# EAGLE schematic vixen-64k (EAGLE 7.7.0)
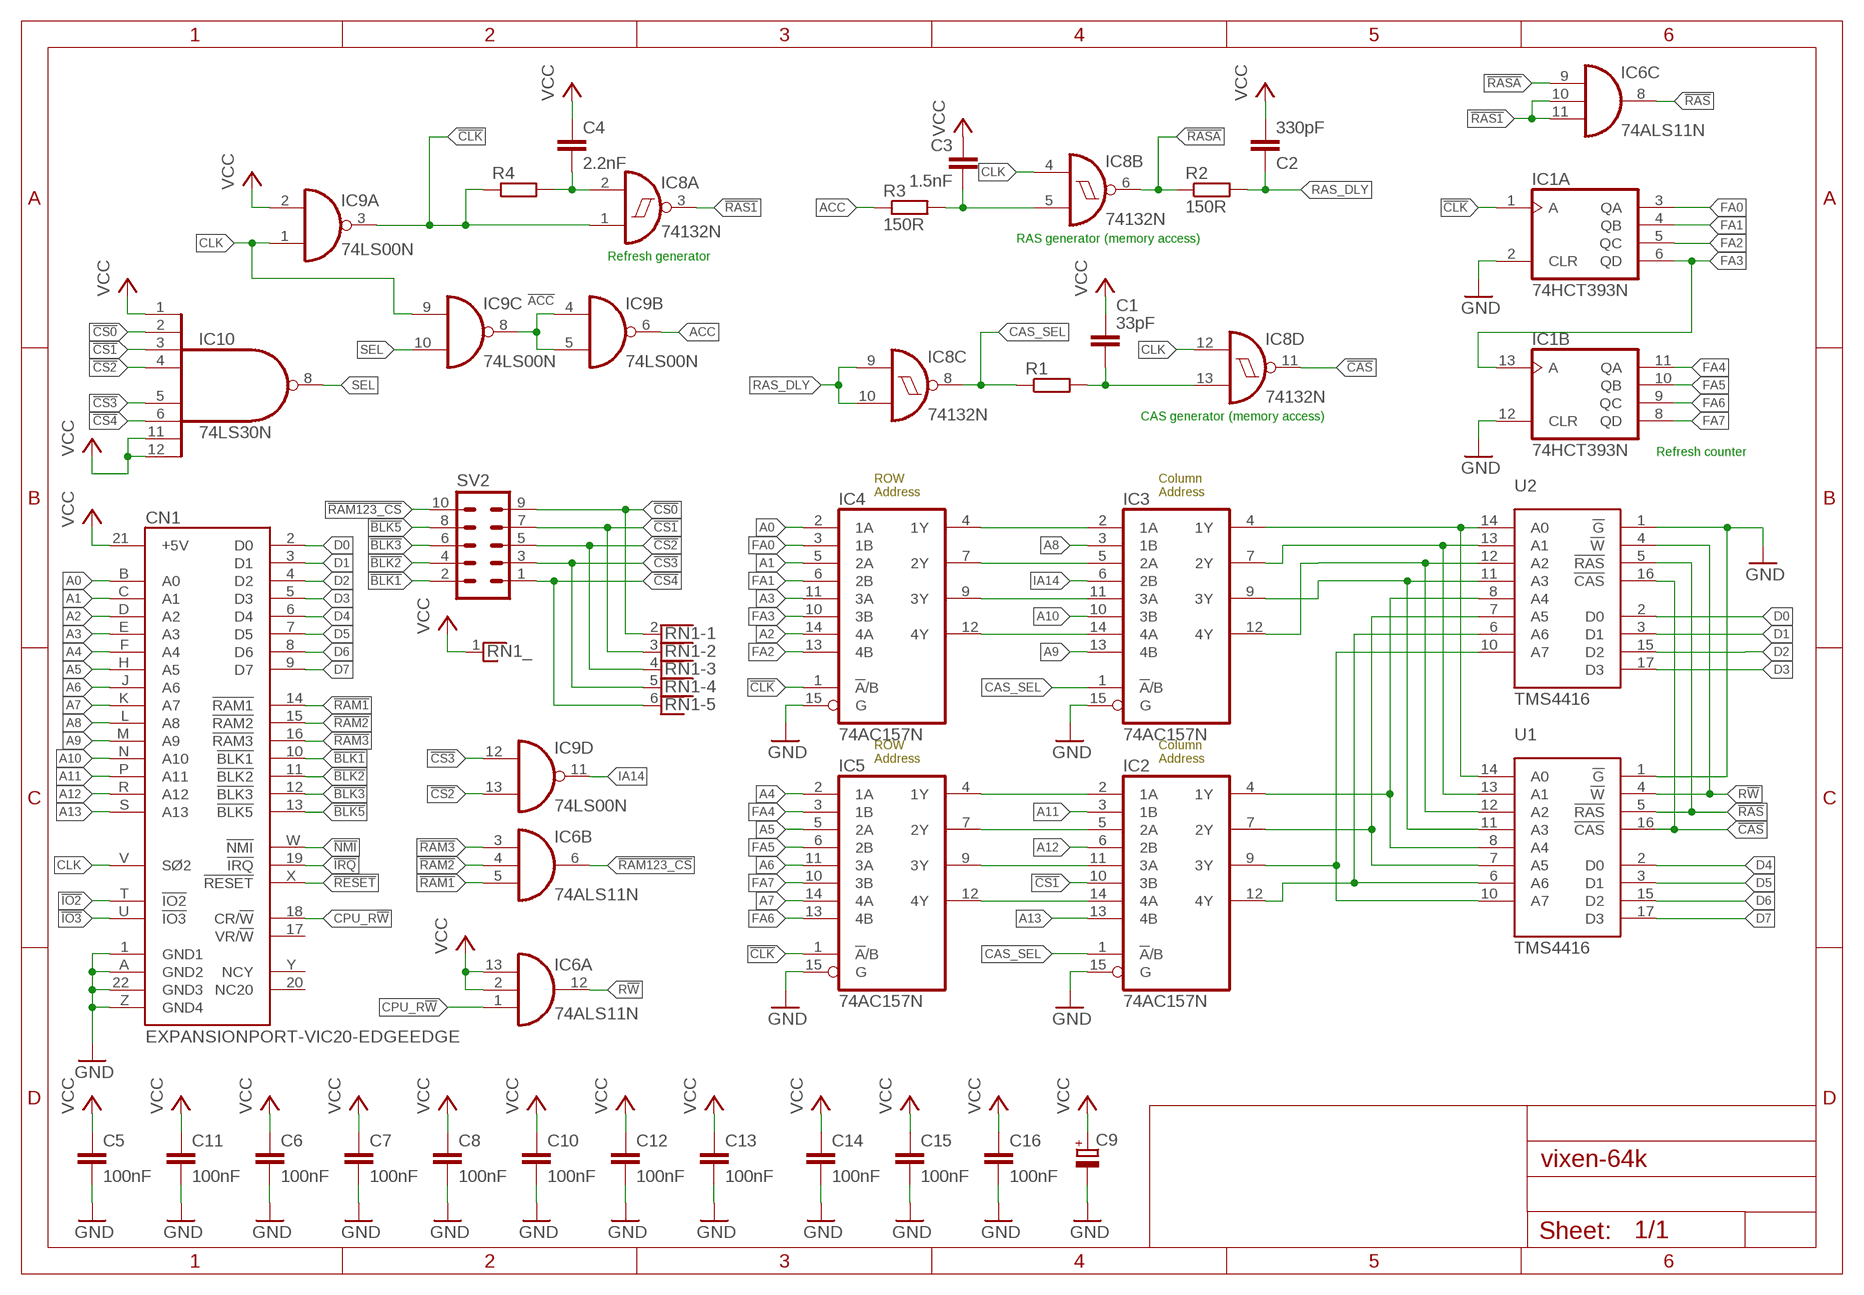
[diagram p0: schematic, sheet 1]

## Parts
C1  33pF  C-EU025-025X050  [C025-025X050]
C2  330pF  C-EU025-025X050  [C025-025X050]
C3  1.5nF  C-EU025-025X050  [C025-025X050]
C4  2.2nF  C-EU025-025X050  [C025-025X050]
C5  100nF  C-EU025-025X050  [C025-025X050]
C6  100nF  C-EU025-025X050  [C025-025X050]
C7  100nF  C-EU025-025X050  [C025-025X050]
C8  100nF  C-EU025-025X050  [C025-025X050]
C9  CPOL-EUE15-5AXIAL  [E15-5]
C10  100nF  C-EU025-025X050  [C025-025X050]
C11  100nF  C-EU025-025X050  [C025-025X050]
C12  100nF  C-EU025-025X050  [C025-025X050]
C13  100nF  C-EU025-025X050  [C025-025X050]
C14  100nF  C-EU025-025X050  [C025-025X050]
C15  100nF  C-EU025-025X050  [C025-025X050]
C16  100nF  C-EU025-025X050  [C025-025X050]
CN1  EXPANSIONPORT-VIC20-EDGEEDGE  [UPS44EDGE]
IC1  74HCT393N  [DIL14]
IC2  74AC157N  [DIL16]
IC3  74AC157N  [DIL16]
IC4  74AC157N  [DIL16]
IC5  74AC157N  [DIL16]
IC6  74ALS11N  [DIL14]
IC8  74132N  [DIL14]
IC9  74LS00N  [DIL14]
IC10  74LS30N  [DIL14]
R1  R-EU_0204/7  [0204/7]
R2  150R  R-EU_0204/7  [0204/7]
R3  150R  R-EU_0204/7  [0204/7]
R4  R-EU_0204/7  [0204/7]
RN1  RNX5  [RN-6]
SV2  MA05-2  [MA05-2]
U1  TMS4416  [DIL18]
U2  TMS4416  [DIL18]

## Nets
!ACC: IC9.4(B:I0) IC9.5(B:I1) IC9.8(C:O)
!BLK1: CN1.10(!BLK1) SV2.2
!BLK2: CN1.11(!BLK2) SV2.4
!BLK3: CN1.12(!BLK3) SV2.6
!BLK5: CN1.13(!BLK5) SV2.8
!CAS: IC8.11(D:O) U1.16(!CAS) U2.16(!CAS)
!CLK: IC1.1(A:A) IC4.1(!A!/B) IC5.1(!A!/B) IC8.1(A:I0) IC9.3(A:O) R4.1
!CS0: IC10.2(I1) RN1.2 SV2.9
!CS1: IC2.10(3B) IC10.3(I2) RN1.3 SV2.7
!CS2: IC9.13(D:I1) IC10.4(I3) RN1.4 SV2.5
!CS3: IC9.12(D:I0) IC10.5(I4) RN1.5 SV2.3
!CS4: IC10.6(I5) RN1.6 SV2.1
!IO2: CN1.T(!IO2)
!IO3: CN1.U(!IO3)
!IRQ: CN1.19(!IRQ)
!NMI: CN1.W(!NMI)
!RAM1: CN1.14(!RAM1) IC6.5(B:I2)
!RAM2: CN1.15(!RAM2) IC6.4(B:I1)
!RAM3: CN1.16(!RAM3) IC6.3(B:I0)
!RAM123_CS: IC6.6(B:O) SV2.10
!RAS: IC6.8(C:O) U1.5(!RAS) U2.5(!RAS)
!RAS1: IC6.10(C:I1) IC6.11(C:I2) IC8.3(A:O)
!RASA: IC6.9(C:I0) IC8.6(B:O) R2.1
!RESET: CN1.X(!RESET)
A0: CN1.B(A0) IC4.2(1A)
A1: CN1.C(A1) IC4.5(2A)
A2: CN1.D(A2) IC4.14(4A)
A3: CN1.E(A3) IC4.11(3A)
A4: CN1.F(A4) IC5.2(1A)
A5: CN1.H(A5) IC5.5(2A)
A6: CN1.J(A6) IC5.11(3A)
A7: CN1.K(A7) IC5.14(4A)
A8: CN1.L(A8) IC3.3(1B)
A9: CN1.M(A9) IC3.13(4B)
A10: CN1.N(A10) IC3.10(3B)
A11: CN1.P(A11) IC2.3(1B)
A12: CN1.R(A12) IC2.6(2B)
A13: CN1.S(A13) IC2.13(4B)
ACC: IC9.6(B:O) R3.1
CAS_RC: C1.2 IC8.13(D:I1) R1.2
CAS_RC1: C4.2 IC8.2(A:I1) R4.2
CAS_SEL: IC2.1(!A!/B) IC3.1(!A!/B) IC8.8(C:O) R1.1
CLK: CN1.V(SØ2) IC8.4(B:I0) IC8.12(D:I0) IC9.1(A:I0) IC9.9(C:I0)
CPU_R!W: CN1.18(CR/!W) IC6.1(A:I0)
D0: CN1.2(D0) U2.2(D0)
D1: CN1.3(D1) U2.3(D1)
D2: CN1.4(D2) U2.15(D2)
D3: CN1.5(D3) U2.17(D3)
D4: CN1.6(D4) U1.2(D0)
D5: CN1.7(D5) U1.3(D1)
D6: CN1.8(D6) U1.15(D2)
D7: CN1.9(D7) U1.17(D3)
FA0: IC1.3(A:QA) IC4.3(1B)
FA1: IC1.4(A:QB) IC4.6(2B)
FA2: IC1.5(A:QC) IC4.13(4B)
FA3: IC1.6(A:QD) IC1.13(B:A) IC4.10(3B)
FA4: IC1.11(B:QA) IC5.3(1B)
FA5: IC1.10(B:QB) IC5.6(2B)
FA6: IC1.9(B:QC) IC5.13(4B)
FA7: IC1.8(B:QD) IC5.10(3B)
GND: C5.2 C6.2 C7.2 C8.2 C9.- C10.2 C11.2 C12.2 C13.2 C14.2 C15.2 C16.2 CN1.1(GND1) CN1.22(GND3) CN1.A(GND2) CN1.Z(GND4) IC1.2(A:CLR) IC1.12(B:CLR) IC2.15(G) IC3.15(G) IC4.15(G) IC5.15(G) U1.1(!G) U2.1(!G)
IA14: IC3.6(2B) IC9.11(D:O)
R!W: IC6.12(A:O) U1.4(!W) U2.4(!W)
RA0: IC3.4(1Y) U1.14(A0) U2.14(A0)
RA1: IC3.7(2Y) U1.13(A1) U2.13(A1)
RA2: IC3.12(4Y) U1.12(A2) U2.12(A2)
RA3: IC3.9(3Y) U1.11(A3) U2.11(A3)
RA4: IC2.4(1Y) U1.8(A4) U2.8(A4)
RA5: IC2.7(2Y) U1.7(A5) U2.7(A5)
RA6: IC2.12(4Y) U1.6(A6) U2.6(A6)
RA7: IC2.9(3Y) U1.10(A7) U2.10(A7)
RAS_DLY: C2.1 IC8.9(C:I0) IC8.10(C:I1) R2.2
RAS_RC1: C3.2 IC8.5(B:I1) R3.2
ROW0: IC3.2(1A) IC4.4(1Y)
ROW1: IC3.5(2A) IC4.7(2Y)
ROW2: IC3.14(4A) IC4.12(4Y)
ROW3: IC3.11(3A) IC4.9(3Y)
ROW4: IC2.2(1A) IC5.4(1Y)
ROW5: IC2.5(2A) IC5.7(2Y)
ROW6: IC2.14(4A) IC5.12(4Y)
ROW7: IC2.11(3A) IC5.9(3Y)
SEL: IC9.10(C:I1) IC10.8(O)
VCC: C1.1 C2.2 C3.1 C4.1 C5.1 C6.1 C7.1 C8.1 C9.+ C10.1 C11.1 C12.1 C13.1 C14.1 C15.1 C16.1 CN1.21(+5V) IC6.2(A:I1) IC6.13(A:I2) IC9.2(A:I1) IC10.1(I0) IC10.11(I6) IC10.12(I7) RN1.1
Unconnected: CN1.17(VR/!W) CN1.20(NC20) CN1.Y(NCY)

## Notes on the sheet
- RAS generator (memory access)
- Refresh generator
- CAS generator (memory access)
- Refresh counter
- ROW
  Address
- Column
  Address
- ROW
  Address
- Column
  Address

## Power pins joined to a net without a drawn wire
GND: IC1.7(P:GND) IC2.8(GND) IC3.8(GND) IC4.8(GND) IC5.8(GND) IC6.7(P:GND) IC8.7(P:GND) IC9.7(P:GND) IC10.7(GND) U1.18(GND) U2.18(GND)
VCC: IC1.14(P:VCC) IC2.16(VCC) IC3.16(VCC) IC4.16(VCC) IC5.16(VCC) IC6.14(P:VCC) IC8.14(P:VCC) IC9.14(P:VCC) IC10.14(VCC) U1.9(VCC) U2.9(VCC)

## Library data of the parts
C1-C8 C10-C16 = rcl:C-EU: CAPACITOR, European symbol
C9 = rcl:CPOL-EU: POLARIZED CAPACITOR, European symbol
CN1 = 0RB_Commodore:EXPANSIONPORT-VIC20-EDGE: Expansionport of the Commodore VIC-20
IC1 = 74xx-eu:74*393: Dual 4-bit decade and binary COUNTER
IC2-IC5 = 74xx-eu:74*157: Quadruple 2-line to 1-line data SELECTOR/MULTIPLEXER
IC6 = 74xx-eu:74*11: Triple 3-input AND gate
IC8 = 74xx-eu:74*132: Quad 2-input NAND schmitt trigger
IC9 = 74xx-eu:74*00: Quad 2-input NAND gate
IC10 = bjd-74us-tssops:74*30: 8-input NAND gate
R1-R4 = rcl:R-EU_: RESISTOR, European symbol
RN1 = resistor-net:RNX5: RESISTOR NETWORK; OC_FARNELL: unknown; OC_NEWARK: unknown
SV2 = con-lstb:MA05-2: PIN HEADER; OC_FARNELL: unknown; OC_NEWARK: unknown
U1 U2 = tms4416:TMS4416